# Altium schematic sheet ReferenciaTensionDDS.V03.R00.SchDoc: Ajuste de Amplitud para DDS
size A4; SheetNumber: 16; SheetTotal: 18
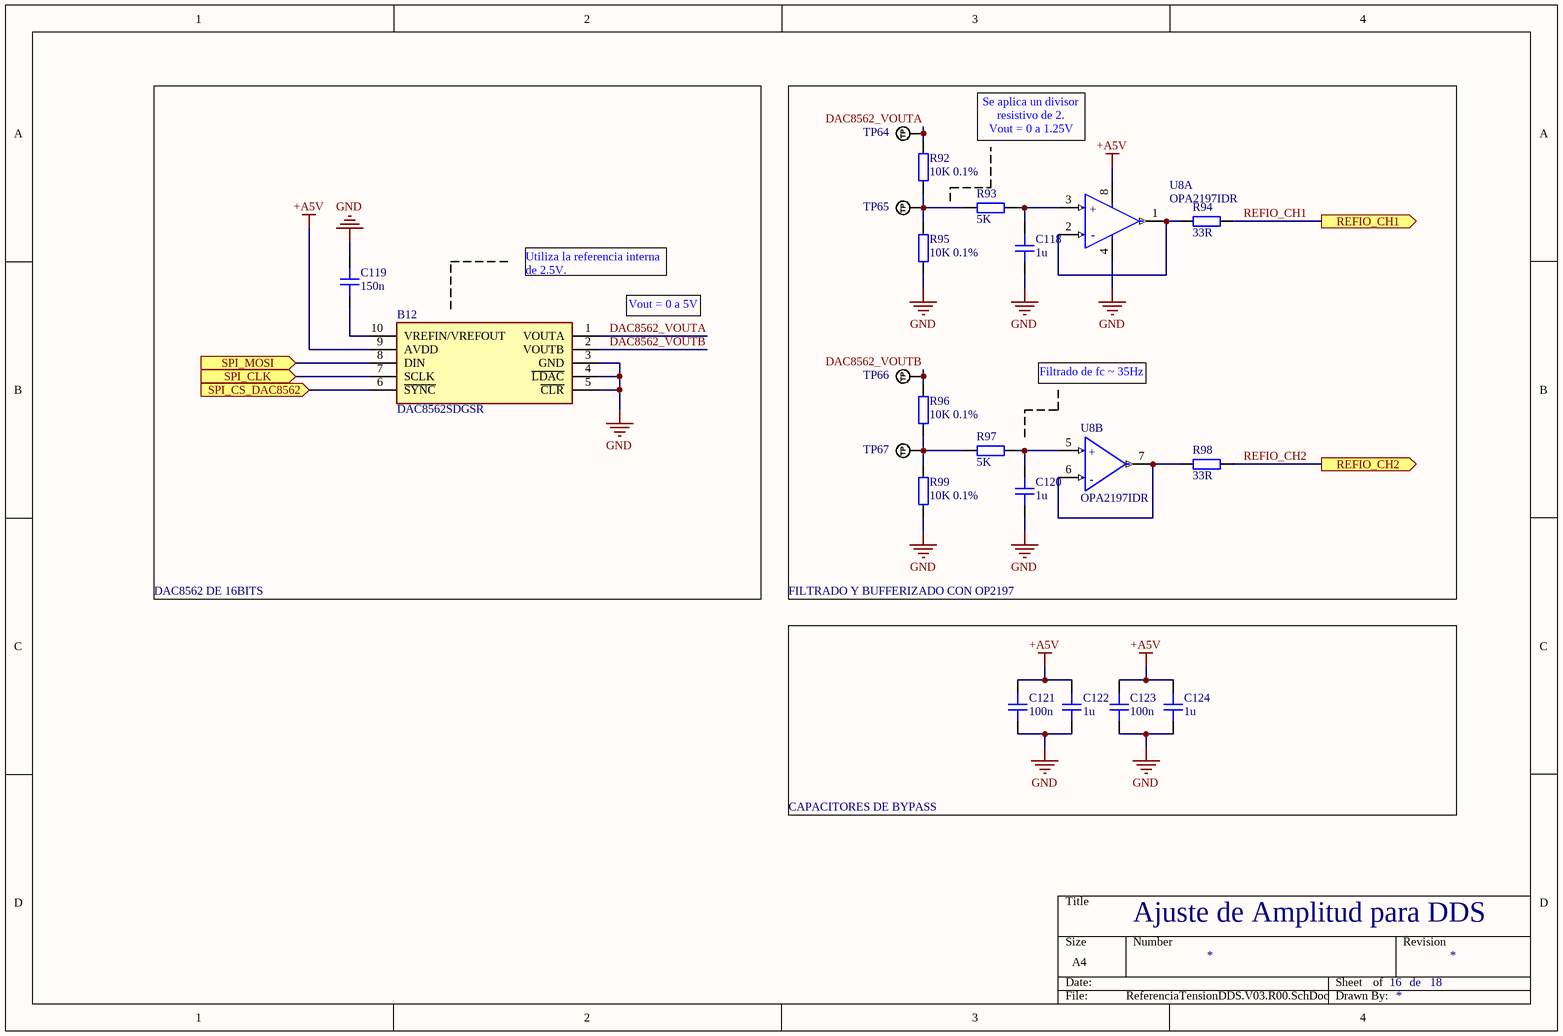
[diagram p0: ReferenciaTensionDDS.V03.R00.SchDoc]

## Parts
B12  DAC8562SDGSR  [SOP50P490X110-10N]
C118  1u  [CAP_0805]
C119  150n  [CAP_0805]
C120  1u  [CAP_0805]
C121  100n  [CAP_0805]
C122  1u  [CAP_0805]
C123  100n  [CAP_0805]
C124  1u  [CAP_0805]
R92  10K 0.1%  [RES_0805]
R93  5K  [RES_0805]
R94  33R  [RES_0805]
R95  10K 0.1%  [RES_0805]
R96  10K 0.1%  [RES_0805]
R97  5K  [RES_0805]
R98  33R  [RES_0805]
R99  10K 0.1%  [RES_0805]
TP64  TP_NOBOM  [PAD_RND_1MM]  (value not drawn)  (no BOM)
TP65  TP_NOBOM  [PAD_RND_1MM]  (value not drawn)  (no BOM)
TP66  TP_NOBOM  [PAD_RND_1MM]  (value not drawn)  (no BOM)
TP67  TP_NOBOM  [PAD_RND_1MM]  (value not drawn)  (no BOM)
U8  OPA2197IDR  [FP-D0008A-MFG]  (parts A,B of 2)

## Blocks framed on the sheet
DAC8562 DE 16BITS: B12 C119
FILTRADO Y BUFFERIZADO CON OP2197: C118 C120 R92-R99 TP64-TP67 U8
CAPACITORES DE BYPASS: C121-C124

## Ports
REFIO_CH1 (out), REFIO_CH2 (out), SPI_CLK (in), SPI_CS_DAC8562 (in), SPI_MOSI (in)

## Nets
+A5V: B12.9(AVDD) C121.2 C122.2 C123.2 C124.2 U8.8(V+)
GND: B12.3(GND) B12.4(~{LDAC}) B12.5(~{CLR}) C118.1 C119.2 C120.1 C121.1 C122.1 C123.1 C124.1 R95.1 R99.1 U8.4(V-)
DAC8562_VOUTA: B12.1(VOUTA) R92.2 TP64.1(TP)
DAC8562_VOUTB: B12.2(VOUTB) R96.2 TP66.1(TP)
REFIO_CH1: R94.2 ; port REFIO_CH1
REFIO_CH2: R98.2 ; port REFIO_CH2
SPI_CLK: B12.7(SCLK) ; port SPI_CLK
SPI_CS_DAC8562: B12.6(~{SYNC}) ; port SPI_CS_DAC8562
SPI_MOSI: B12.8(DIN) ; port SPI_MOSI
NetB12_10: B12.10(VREFIN/VREFOUT) C119.1
NetC118_2: C118.2 R93.2 U8.3(+IN_A)
NetC120_2: C120.2 R97.2 U8.5(+IN_B)
NetR92_1: R92.1 R93.1 R95.2 TP65.1(TP)
NetR94_1: R94.1 U8.1(OUT_A) U8.2(-IN_A)
NetR96_1: R96.1 R97.1 R99.2 TP67.1(TP)
NetR98_1: R98.1 U8.6(-IN_B) U8.7(OUT_B)

## Notes on the sheet
- Se aplica un divisor resistivo de 2.
  Vout = 0 a 1.25V
- Utiliza la referencia interna de 2.5V.
- Vout = 0 a 5V
- Filtrado de fc ~ 35Hz
- de
- (in symbol CMP-04895-000044-1, part A) +; -
- (in symbol CMP-04895-000044-1, part B) +; -

## Library data of the parts
B12 = DAC8562SDGSR: 16-bit, dual-channel, low-power, ultra-low glitch, voltage output DAC with 2.5V, 4ppm/C reference; Manufacturer_Name: Texas Instruments; Geometry.Height: 1.1mm; Mouser Part Number: 595-DAC8562SDGSR; Mouser Price/Stock: https://www.mouser.co.uk/ProductDetail/Texas-Instruments/DAC8562SDGSR?qs=L4ss%2FyqpMWQjhHzbOFnTNg%3D%3D; Manufacturer_Part_Number: DAC8562SDGSR; Datasheet Link: http://www.ti.com/lit/gpn/dac8562
C118-C124 = CAP_0805: Capacitor SMD 0805; Manufacturer: *; Manufacturer Part Number: *; Distributor Link: *; LCSC: *; Rating: *; Dielectric: *
R92-R99 = RES_0805: Resistor SMD 0805; Manufacturer: *; Manufacturer Part Number: *; Distributor Link: *; LCSC: *
TP64-TP67 = TEST_POINT_RND_1MM: Test Point Round 1mm (NO BOM)
U8 = CMP-04895-000044-1: IC OP AMP GP RR 10MHZ 8-SOIC; Manufacturer: Texas Instruments; Output Current Per Channel: 65mA; Min Supply Voltage: 4.5V; Input Offset Voltage: 0.025mV; Number Of Channels: 2; Voltage Gain: 134-143dB; Max Dual Supply Voltage: 18V; Min Dual Supply Voltage: 2.25V; Standoff Height: 0.11mm; Max Supply Voltage: 36V; Input Bias Current: 0.000005uA; Nominal Supply Current: 1mA; Max Junction Temp: +150°C; Temperature Range Low: -40°C; Package: D0008A; Temperature: -40°C to +125°C; Gain Bandwidth: 10MHz; Category: IC; Digikey Description: IC OP AMP GP RR 10MHZ 8-SOIC; Automotive: No; Height: 1.75mm; Ambient Temperature Range Low: -40°C; Device Class L3: Amplifiers - Op Amps; ComponentLink2URL: http://www.ti.com/lit/ds/symlink/opa2197.pdf; Lead Free: Yes; RoHS: TRUE; Manufacturer Part Number: OPA2197IDR; Device Class L1: Integrated Circuits (ICs); ComponentLink2Description: Datasheet; Ipc Land Pattern Name: SOIC127P600X175-8; Device Class L2: Linear ICs; Temperature Range High: +125°C; Octopart: https://octopart.com/opa2197idr-texas+instruments-75179702; Ambient Temperature Range High: +125°C